# Altium schematic sheet Main.SchDoc: Плата
size 594 x 420 mm; CompanyName: ООО "ЛАССАРД"; Address1: Address1; Address2: Address2; Address3: Address3; Address4: Address4; DocumentNumber: *Э3; SheetNumber: 1; SheetTotal: 14; Title2str: управления; DocumentType: Схема электрическая принципиальная
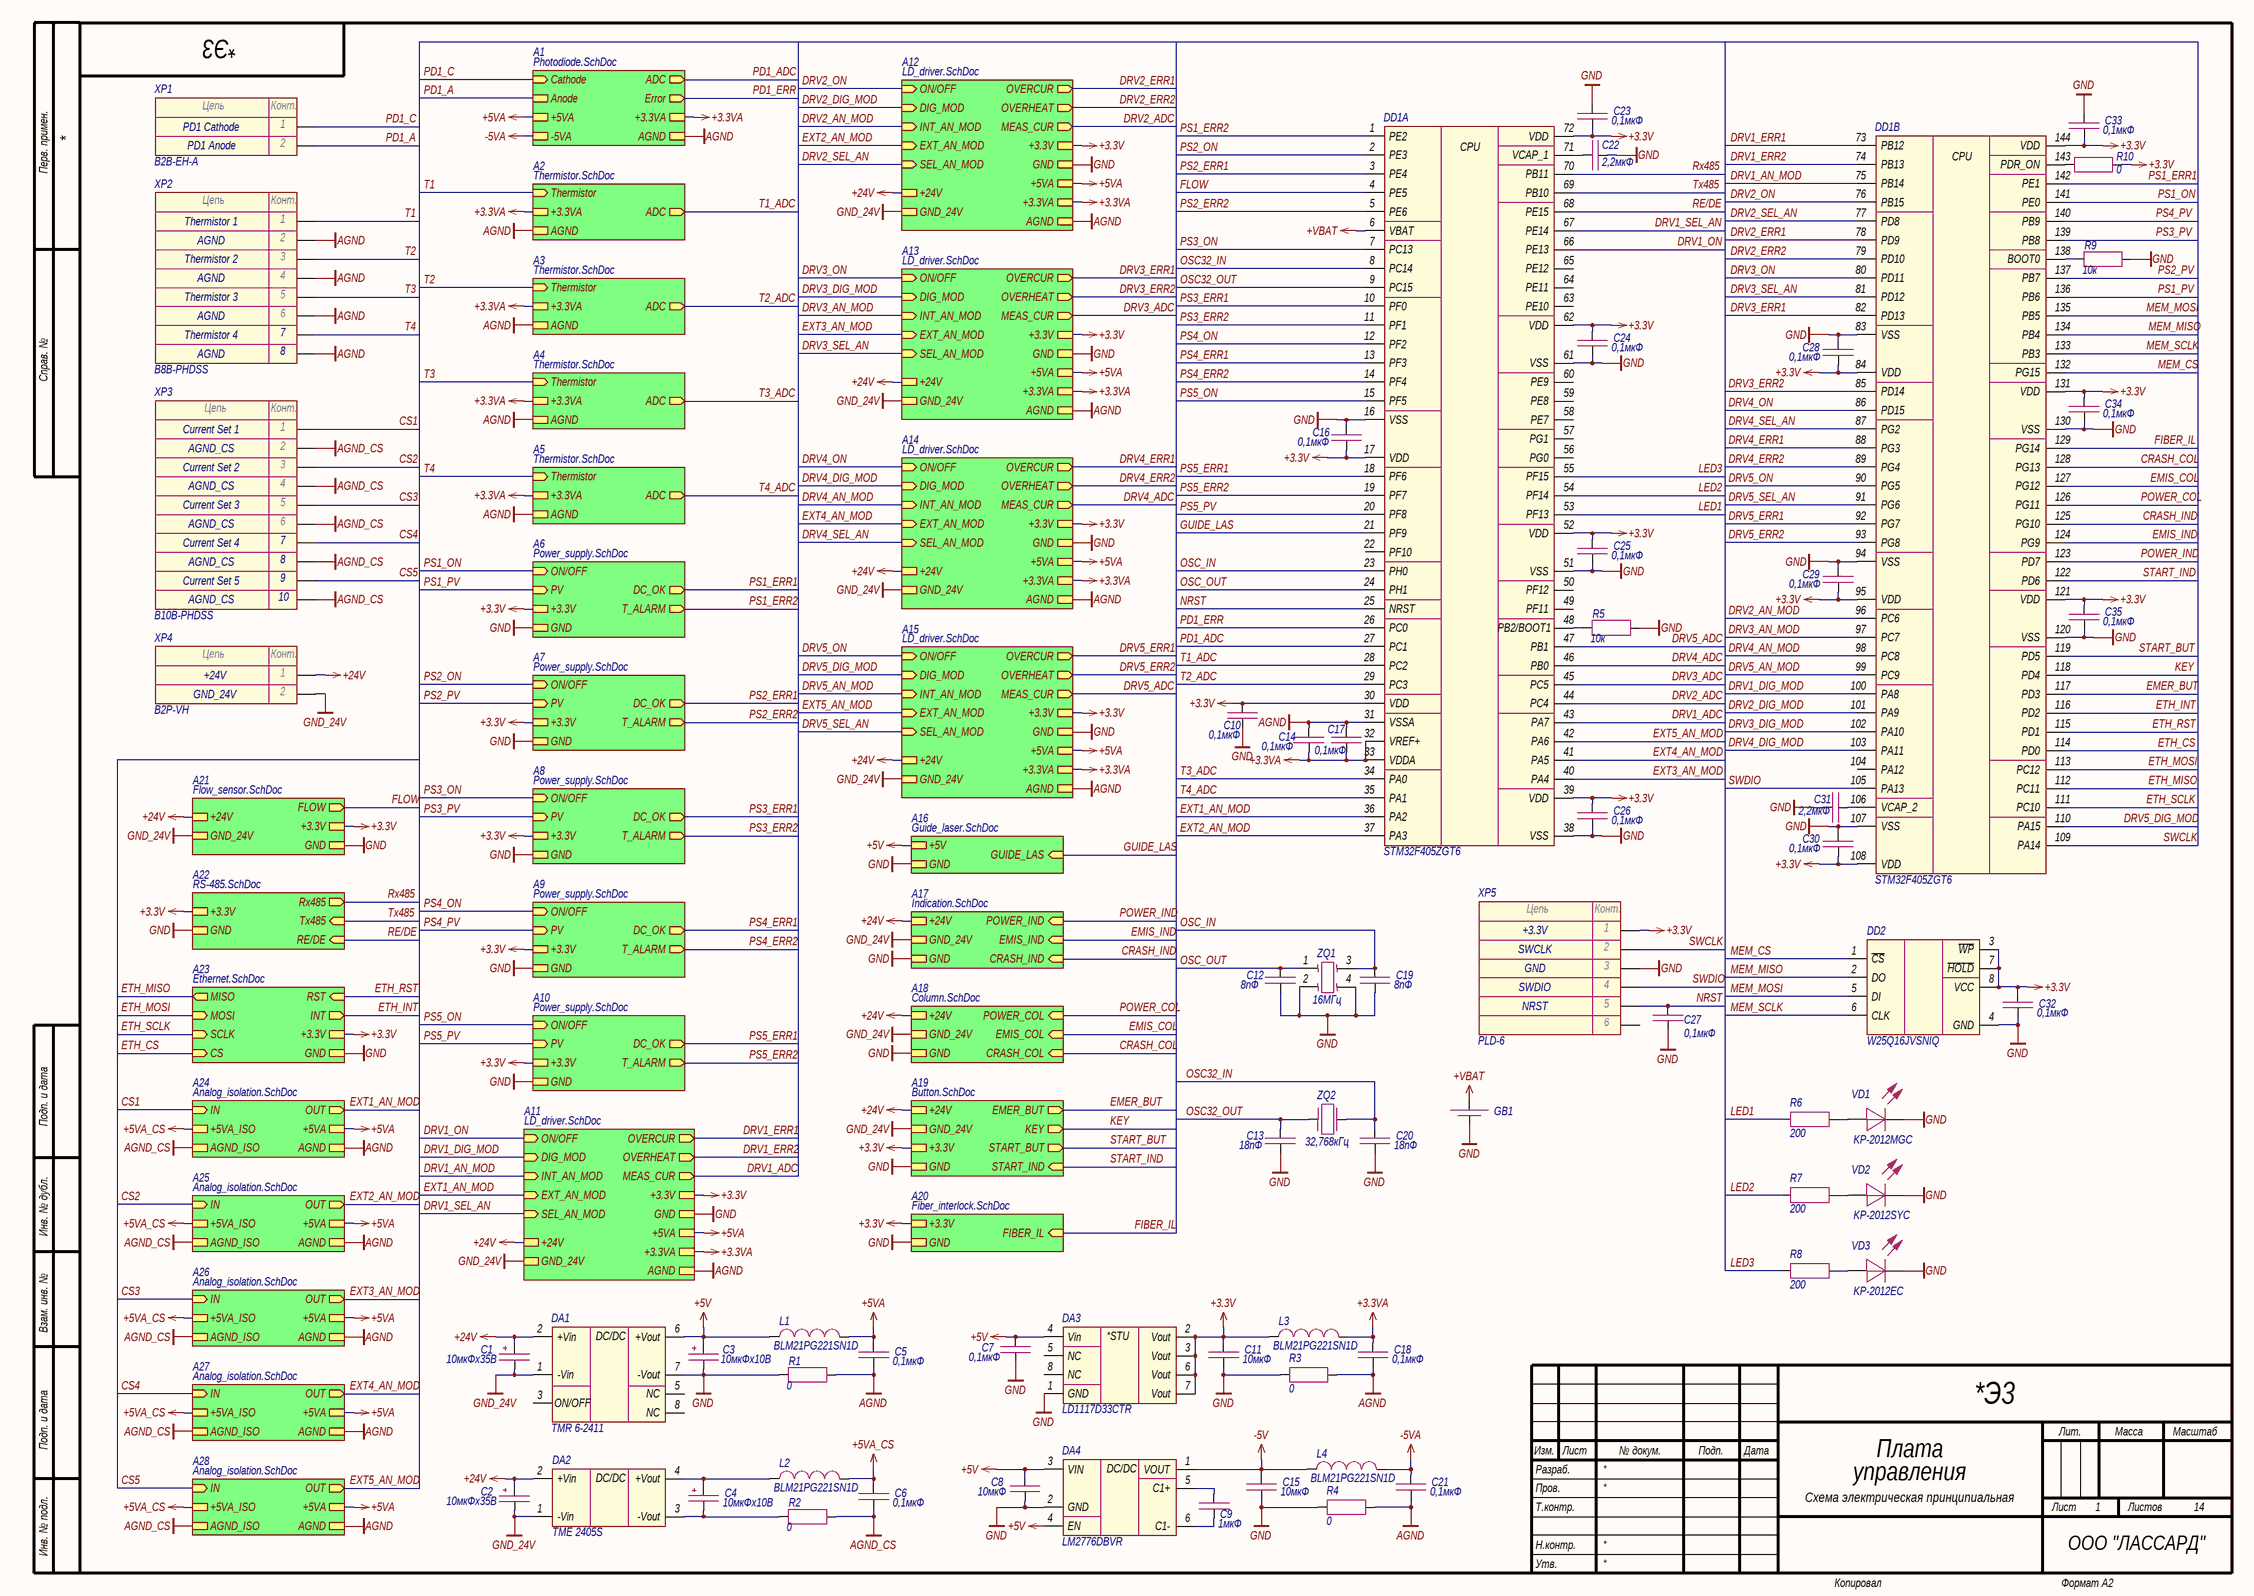
[diagram p0: Main.SchDoc]

## Parts
C1  10мкФх35B  [CAP_C]
C2  10мкФх35B  [CAP_C]
C3  10мкФх10B  [CAP_A]
C4  10мкФх10B  [CAP_A]
C5  0,1мкФ  [CAP_0603]
C6  0,1мкФ  [CAP_0603]
C7  0,1мкФ  [CAP_0603]
C8  10мкФ  [CAP_0603]
C9  1мкФ  [CAP_0603]
C10  0,1мкФ  [CAP_0603]
C11  10мкФ  [CAP_0603]
C12  8пФ  [CAP_0603]
C13  18пФ  [CAP_0603]
C14  0,1мкФ  [CAP_0603]
C15  10мкФ  [CAP_0603]
C16  0,1мкФ  [CAP_0603]
C17  0,1мкФ  [CAP_0603]
C18  0,1мкФ  [CAP_0603]
C19  8пФ  [CAP_0603]
C20  18пФ  [CAP_0603]
C21  0,1мкФ  [CAP_0603]
C22  2,2мкФ  [CAP_0603]
C23  0,1мкФ  [CAP_0603]
C24  0,1мкФ  [CAP_0603]
C25  0,1мкФ  [CAP_0603]
C26  0,1мкФ  [CAP_0603]
C27  0,1мкФ  [CAP_0603]
C28  0,1мкФ  [CAP_0603]
C29  0,1мкФ  [CAP_0603]
C30  0,1мкФ  [CAP_0603]
C31  2,2мкФ  [CAP_0603]
C32  0,1мкФ  [CAP_0603]
C33  0,1мкФ  [CAP_0603]
C34  0,1мкФ  [CAP_0603]
C35  0,1мкФ  [CAP_0603]
DA1  TMR 6-2411  [TMR3 (SIP-8)]
DA2  TME 2405S  [TME (SIP-4)]
DA3  LD1117D33CTR  [SOIC-8]
DA4  LM2776DBVR  [SOT-23-6]
DD1  STM32F405ZGT6  [LQFP-144]  (parts A,B of 2)
DD2  W25Q16JVSNIQ  [SOIC-8]
GB1  DS1092-12-N8S  [DS1092-12-N8S]  (value not drawn)
L1  BLM21PG221SN1D  [IND_0805]
L2  BLM21PG221SN1D  [IND_0805]
L3  BLM21PG221SN1D  [IND_0805]
L4  BLM21PG221SN1D  [IND_0805]
R1  0  [RES_0805]
R2  0  [RES_0805]
R3  0  [RES_0805]
R4  0  [RES_0805]
R5  10к  [RES_0603]
R6  200  [RES_0603]
R7  200  [RES_0603]
R8  200  [RES_0603]
R9  10к  [RES_0603]
R10  0  [RES_0603]
VD1  KP-2012MGC  [LED_0805]
VD2  KP-2012SYC  [LED_0805]
VD3  KP-2012EC  [LED_0805]
XP1  B2B-EH-A  [B2B-EH-A]
XP2  B8B-PHDSS  [B8B-PHDSS]
XP3  B10B-PHDSS  [B10B-PHDSS]
XP4  B2P-VH  [B2P-VH]
XP5  PLD-6  [PLD-6]
ZQ1  16МГц  [NX2520SA]
ZQ2  32,768кГц  [NX3215SA]

## Sub-sheets
A1 = Photodiode.SchDoc: ADC (out), Error (out), AGND, +5VA, +3.3VA, Anode, -5VA, Cathode (in)
A2 = Thermistor.SchDoc: Thermistor (in), +3.3VA, AGND, ADC (out)
A3 = Thermistor.SchDoc: Thermistor (in), +3.3VA, AGND, ADC (out)
A4 = Thermistor.SchDoc: Thermistor (in), +3.3VA, AGND, ADC (out)
A5 = Thermistor.SchDoc: Thermistor (in), +3.3VA, AGND, ADC (out)
A6 = Power_supply.SchDoc: ON/OFF (in), PV (in), +3.3V, GND, DC_OK (out), T_ALARM (out)
A7 = Power_supply.SchDoc: ON/OFF (in), PV (in), +3.3V, GND, DC_OK (out), T_ALARM (out)
A8 = Power_supply.SchDoc: ON/OFF (in), PV (in), +3.3V, GND, DC_OK (out), T_ALARM (out)
A9 = Power_supply.SchDoc: ON/OFF (in), PV (in), +3.3V, GND, DC_OK (out), T_ALARM (out)
A10 = Power_supply.SchDoc: ON/OFF (in), PV (in), +3.3V, GND, DC_OK (out), T_ALARM (out)
A11 = LD_driver.SchDoc: +3.3V, GND, OVERCUR (out), OVERHEAT (out), +24V, GND_24V, ON/OFF (in), DIG_MOD (in), INT_AN_MOD (in), EXT_AN_MOD (in), SEL_AN_MOD (in), MEAS_CUR (out), +5VA, +3.3VA, AGND
A12 = LD_driver.SchDoc: +3.3V, GND, OVERCUR (out), OVERHEAT (out), +24V, GND_24V, ON/OFF (in), DIG_MOD (in), INT_AN_MOD (in), EXT_AN_MOD (in), SEL_AN_MOD (in), MEAS_CUR (out), +5VA, +3.3VA, AGND
A13 = LD_driver.SchDoc: +3.3V, GND, OVERCUR (out), OVERHEAT (out), +24V, GND_24V, ON/OFF (in), DIG_MOD (in), INT_AN_MOD (in), EXT_AN_MOD (in), SEL_AN_MOD (in), MEAS_CUR (out), +5VA, +3.3VA, AGND
A14 = LD_driver.SchDoc: +3.3V, GND, OVERCUR (out), OVERHEAT (out), +24V, GND_24V, ON/OFF (in), DIG_MOD (in), INT_AN_MOD (in), EXT_AN_MOD (in), SEL_AN_MOD (in), MEAS_CUR (out), +5VA, +3.3VA, AGND
A15 = LD_driver.SchDoc: +3.3V, GND, OVERCUR (out), OVERHEAT (out), +24V, GND_24V, ON/OFF (in), DIG_MOD (in), INT_AN_MOD (in), EXT_AN_MOD (in), SEL_AN_MOD (in), MEAS_CUR (out), +5VA, +3.3VA, AGND
A16 = Guide_laser.SchDoc: GUIDE_LAS (in), +5V, GND
A17 = Indication.SchDoc: GND_24V, +24V, CRASH_IND (in), POWER_IND (in), EMIS_IND (in), GND
A18 = Column.SchDoc: GND_24V, +24V, CRASH_COL (in), POWER_COL (in), EMIS_COL (in), GND
A19 = Button.SchDoc: EMER_BUT (out), +24V, GND_24V, +3.3V, GND, KEY (out), START_BUT (out), START_IND (in)
A20 = Fiber_interlock.SchDoc: FIBER_IL (in), +3.3V, GND
A21 = Flow_sensor.SchDoc: FLOW (out), +24V, GND_24V, +3.3V, GND
A22 = RS-485.SchDoc: Rx485 (out), Tx485 (in), RE/DE (in), +3.3V, GND
A23 = Ethernet.SchDoc: MISO (out), RST (in), MOSI (in), INT (out), SCLK (in), CS (in), +3.3V, GND
A24 = Analog_isolation.SchDoc: IN (in), +5VA_ISO, AGND_ISO, OUT (out), AGND, +5VA
A25 = Analog_isolation.SchDoc: IN (in), +5VA_ISO, AGND_ISO, OUT (out), AGND, +5VA
A26 = Analog_isolation.SchDoc: IN (in), +5VA_ISO, AGND_ISO, OUT (out), AGND, +5VA
A27 = Analog_isolation.SchDoc: IN (in), +5VA_ISO, AGND_ISO, OUT (out), AGND, +5VA
A28 = Analog_isolation.SchDoc: IN (in), +5VA_ISO, AGND_ISO, OUT (out), +5VA, AGND

## Nets
+3.3V: C10.1 C11.1 C16.2 C23.2 C24.1 C25.1 C26.1 C28.2 C29.2 C30.2 C32.1 C33.2 C34.1 C35.1 DA3.2(Vout) DA3.3(Vout) DA3.6(Vout) DA3.7(Vout) DD1.17(VDD) DD1.30(VDD) DD1.39(VDD) DD1.52(VDD) DD1.62(VDD) DD1.72(VDD) DD1.84(VDD) DD1.95(VDD) DD1.108(VDD) DD1.121(VDD) DD1.131(VDD) DD1.144(VDD) DD2.3(~{WP}) DD2.7(~{HOLD}) DD2.8(VCC) L3.1 R10.2 XP5.1 ; sheet A6/+3.3V, sheet A7/+3.3V, sheet A8/+3.3V, sheet A9/+3.3V, sheet A10/+3.3V, sheet A11/+3.3V, sheet A12/+3.3V, sheet A13/+3.3V, sheet A14/+3.3V, sheet A15/+3.3V, sheet A19/+3.3V, sheet A20/+3.3V, sheet A21/+3.3V, sheet A22/+3.3V, sheet A23/+3.3V
+3.3VA: C14.2 C17.2 C18.1 DD1.32(VREF+) DD1.33(VDDA) L3.2 ; sheet A1/+3.3VA, sheet A5/+3.3VA, sheet A2/+3.3VA, sheet A3/+3.3VA, sheet A4/+3.3VA, sheet A11/+3.3VA, sheet A12/+3.3VA, sheet A13/+3.3VA, sheet A14/+3.3VA, sheet A15/+3.3VA
+5V: C3.1 C7.2 C8.1 DA1.6(+Vout) DA3.4(Vin) DA4.3(VIN) DA4.4(EN) L1.1 ; sheet A16/+5V
+5VA: C5.1 L1.2 ; sheet A1/+5VA, sheet A11/+5VA, sheet A12/+5VA, sheet A13/+5VA, sheet A14/+5VA, sheet A15/+5VA, sheet A24/+5VA, sheet A25/+5VA, sheet A26/+5VA, sheet A27/+5VA, sheet A28/+5VA
+5VA_CS: C6.1 L2.2 ; sheet A24/+5VA_ISO, sheet A25/+5VA_ISO, sheet A26/+5VA_ISO, sheet A27/+5VA_ISO, sheet A28/+5VA_ISO
+24V: C1.1 C2.1 DA1.2(+Vin) DA2.2(+Vin) XP4.1 ; sheet A11/+24V, sheet A12/+24V, sheet A13/+24V, sheet A14/+24V, sheet A15/+24V, sheet A17/+24V, sheet A18/+24V, sheet A19/+24V, sheet A21/+24V
+VBAT: DD1.6(VBAT) GB1.2
-5V: C15.1 DA4.1(VOUT) L4.1
-5VA: C21.1 L4.2 ; sheet A1/-5VA
AGND: C5.2 C14.1 C17.1 C18.2 C21.2 DD1.31(VSSA) R1.2 R3.2 R4.2 XP2.2 XP2.4 XP2.6 XP2.8 ; sheet A1/AGND, sheet A5/AGND, sheet A2/AGND, sheet A3/AGND, sheet A4/AGND, sheet A11/AGND, sheet A12/AGND, sheet A13/AGND, sheet A14/AGND, sheet A15/AGND, sheet A24/AGND, sheet A25/AGND, sheet A26/AGND, sheet A27/AGND, sheet A28/AGND
AGND_CS: C6.2 R2.2 XP3.2 XP3.4 XP3.6 XP3.8 XP3.10 ; sheet A24/AGND_ISO, sheet A25/AGND_ISO, sheet A26/AGND_ISO, sheet A27/AGND_ISO, sheet A28/AGND_ISO
GND: C3.2 C7.1 C8.2 C10.2 C11.2 C12.2 C13.2 C15.2 C16.1 C19.2 C20.2 C22.2 C23.1 C24.2 C25.2 C26.2 C27.2 C28.1 C29.1 C30.1 C31.2 C32.2 C33.1 C34.2 C35.2 DA1.7(-Vout) DA3.1(GND) DA4.2(GND) DD1.16(VSS) DD1.38(VSS) DD1.51(VSS) DD1.61(VSS) DD1.83(VSS) DD1.94(VSS) DD1.107(VSS) DD1.120(VSS) DD1.130(VSS) DD2.4(GND) GB1.1 R1.1 R3.1 R4.1 R5.2 R9.2 VD1.2(C) VD2.2(C) VD3.2(C) XP5.3 ZQ1.2 ZQ1.4 ; sheet A6/GND, sheet A7/GND, sheet A8/GND, sheet A9/GND, sheet A10/GND, sheet A11/GND, sheet A12/GND, sheet A13/GND, sheet A14/GND, sheet A15/GND, sheet A16/GND, sheet A17/GND, sheet A18/GND, sheet A19/GND, sheet A20/GND, sheet A21/GND, sheet A22/GND, sheet A23/GND
GND_24V: C1.2 C2.2 DA1.1(-Vin) DA2.1(-Vin) XP4.2 ; sheet A11/GND_24V, sheet A12/GND_24V, sheet A13/GND_24V, sheet A14/GND_24V, sheet A15/GND_24V, sheet A17/GND_24V, sheet A18/GND_24V, sheet A19/GND_24V, sheet A21/GND_24V
CRASH_COL: DD1.128(PG13) ; sheet A18/CRASH_COL
CRASH_IND: DD1.125(PG10) ; sheet A17/CRASH_IND
CS1: XP3.1 ; sheet A24/IN
CS2: XP3.3 ; sheet A25/IN
CS3: XP3.5 ; sheet A26/IN
CS4: XP3.7 ; sheet A27/IN
CS5: XP3.9 ; sheet A28/IN
DRV1_ADC: DD1.43(PA7) ; sheet A11/MEAS_CUR
DRV1_AN_MOD: DD1.75(PB14) ; sheet A11/INT_AN_MOD
DRV1_DIG_MOD: DD1.100(PA8) ; sheet A11/DIG_MOD
DRV1_ERR1: DD1.73(PB12) ; sheet A11/OVERCUR
DRV1_ERR2: DD1.74(PB13) ; sheet A11/OVERHEAT
DRV1_ON: DD1.66(PE13) ; sheet A11/ON/OFF
DRV1_SEL_AN: DD1.67(PE14) ; sheet A11/SEL_AN_MOD
DRV2_ADC: DD1.44(PC4) ; sheet A12/MEAS_CUR
DRV2_AN_MOD: DD1.96(PC6) ; sheet A12/INT_AN_MOD
DRV2_DIG_MOD: DD1.101(PA9) ; sheet A12/DIG_MOD
DRV2_ERR1: DD1.78(PD9) ; sheet A12/OVERCUR
DRV2_ERR2: DD1.79(PD10) ; sheet A12/OVERHEAT
DRV2_ON: DD1.76(PB15) ; sheet A12/ON/OFF
DRV2_SEL_AN: DD1.77(PD8) ; sheet A12/SEL_AN_MOD
DRV3_ADC: DD1.45(PC5) ; sheet A13/MEAS_CUR
DRV3_AN_MOD: DD1.97(PC7) ; sheet A13/INT_AN_MOD
DRV3_DIG_MOD: DD1.102(PA10) ; sheet A13/DIG_MOD
DRV3_ERR1: DD1.82(PD13) ; sheet A13/OVERCUR
DRV3_ERR2: DD1.85(PD14) ; sheet A13/OVERHEAT
DRV3_ON: DD1.80(PD11) ; sheet A13/ON/OFF
DRV3_SEL_AN: DD1.81(PD12) ; sheet A13/SEL_AN_MOD
DRV4_ADC: DD1.46(PB0) ; sheet A14/MEAS_CUR
DRV4_AN_MOD: DD1.98(PC8) ; sheet A14/INT_AN_MOD
DRV4_DIG_MOD: DD1.103(PA11) ; sheet A14/DIG_MOD
DRV4_ERR1: DD1.88(PG3) ; sheet A14/OVERCUR
DRV4_ERR2: DD1.89(PG4) ; sheet A14/OVERHEAT
DRV4_ON: DD1.86(PD15) ; sheet A14/ON/OFF
DRV4_SEL_AN: DD1.87(PG2) ; sheet A14/SEL_AN_MOD
DRV5_ADC: DD1.47(PB1) ; sheet A15/MEAS_CUR
DRV5_AN_MOD: DD1.99(PC9) ; sheet A15/INT_AN_MOD
DRV5_DIG_MOD: DD1.110(PA15) ; sheet A15/DIG_MOD
DRV5_ERR1: DD1.92(PG7) ; sheet A15/OVERCUR
DRV5_ERR2: DD1.93(PG8) ; sheet A15/OVERHEAT
DRV5_ON: DD1.90(PG5) ; sheet A15/ON/OFF
DRV5_SEL_AN: DD1.91(PG6) ; sheet A15/SEL_AN_MOD
EMER_BUT: DD1.117(PD3) ; sheet A19/EMER_BUT
EMIS_COL: DD1.127(PG12) ; sheet A18/EMIS_COL
EMIS_IND: DD1.124(PG9) ; sheet A17/EMIS_IND
ETH_CS: DD1.114(PD0) ; sheet A23/CS
ETH_INT: DD1.116(PD2) ; sheet A23/INT
ETH_MISO: DD1.112(PC11) ; sheet A23/MISO
ETH_MOSI: DD1.113(PC12) ; sheet A23/MOSI
ETH_RST: DD1.115(PD1) ; sheet A23/RST
ETH_SCLK: DD1.111(PC10) ; sheet A23/SCLK
EXT1_AN_MOD: DD1.36(PA2) ; sheet A11/EXT_AN_MOD, sheet A24/OUT
EXT2_AN_MOD: DD1.37(PA3) ; sheet A12/EXT_AN_MOD, sheet A25/OUT
EXT3_AN_MOD: DD1.40(PA4) ; sheet A13/EXT_AN_MOD, sheet A26/OUT
EXT4_AN_MOD: DD1.41(PA5) ; sheet A14/EXT_AN_MOD, sheet A27/OUT
EXT5_AN_MOD: DD1.42(PA6) ; sheet A15/EXT_AN_MOD, sheet A28/OUT
FIBER_IL: DD1.129(PG14) ; sheet A20/FIBER_IL
FLOW: DD1.4(PE5) ; sheet A21/FLOW
GUIDE_LAS: DD1.21(PF9) ; sheet A16/GUIDE_LAS
KEY: DD1.118(PD4) ; sheet A19/KEY
LED1: DD1.53(PF13) R6.1
LED2: DD1.54(PF14) R7.1
LED3: DD1.55(PF15) R8.1
MEM_CS: DD1.132(PG15) DD2.1(~{CS})
MEM_MISO: DD1.134(PB4) DD2.2(DO)
MEM_MOSI: DD1.135(PB5) DD2.5(DI)
MEM_SCLK: DD1.133(PB3) DD2.6(CLK)
NRST: C27.1 DD1.25(NRST) XP5.5
OSC32_IN: C20.1 DD1.8(PC14) ZQ2.2
OSC32_OUT: C13.1 DD1.9(PC15) ZQ2.1
OSC_IN: C19.1 DD1.23(PH0) ZQ1.3
OSC_OUT: C12.1 DD1.24(PH1) ZQ1.1
PD1_A: XP1.2 ; sheet A1/Anode
PD1_ADC: DD1.27(PC1) ; sheet A1/ADC
PD1_C: XP1.1 ; sheet A1/Cathode
PD1_ERR: DD1.26(PC0) ; sheet A1/Error
POWER_COL: DD1.126(PG11) ; sheet A18/POWER_COL
POWER_IND: DD1.123(PD7) ; sheet A17/POWER_IND
PS1_ERR1: DD1.142(PE1) ; sheet A6/DC_OK
PS1_ERR2: DD1.1(PE2) ; sheet A6/T_ALARM
PS1_ON: DD1.141(PE0) ; sheet A6/ON/OFF
PS1_PV: DD1.136(PB6) ; sheet A6/PV
PS2_ERR1: DD1.3(PE4) ; sheet A7/DC_OK
PS2_ERR2: DD1.5(PE6) ; sheet A7/T_ALARM
PS2_ON: DD1.2(PE3) ; sheet A7/ON/OFF
PS2_PV: DD1.137(PB7) ; sheet A7/PV
PS3_ERR1: DD1.10(PF0) ; sheet A8/DC_OK
PS3_ERR2: DD1.11(PF1) ; sheet A8/T_ALARM
PS3_ON: DD1.7(PC13) ; sheet A8/ON/OFF
PS3_PV: DD1.139(PB8) ; sheet A8/PV
PS4_ERR1: DD1.13(PF3) ; sheet A9/DC_OK
PS4_ERR2: DD1.14(PF4) ; sheet A9/T_ALARM
PS4_ON: DD1.12(PF2) ; sheet A9/ON/OFF
PS4_PV: DD1.140(PB9) ; sheet A9/PV
PS5_ERR1: DD1.18(PF6) ; sheet A10/DC_OK
PS5_ERR2: DD1.19(PF7) ; sheet A10/T_ALARM
PS5_ON: DD1.15(PF5) ; sheet A10/ON/OFF
PS5_PV: DD1.20(PF8) ; sheet A10/PV
RE/DE: DD1.68(PE15) ; sheet A22/RE/DE
Rx485: DD1.70(PB11) ; sheet A22/Rx485
START_BUT: DD1.119(PD5) ; sheet A19/START_BUT
START_IND: DD1.122(PD6) ; sheet A19/START_IND
SWCLK: DD1.109(PA14) XP5.2
SWDIO: DD1.105(PA13) XP5.4
T1: XP2.1 ; sheet A2/Thermistor
T1_ADC: DD1.28(PC2) ; sheet A2/ADC
T2: XP2.3 ; sheet A3/Thermistor
T2_ADC: DD1.29(PC3) ; sheet A3/ADC
T3: XP2.5 ; sheet A4/Thermistor
T3_ADC: DD1.34(PA0) ; sheet A4/ADC
T4: XP2.7 ; sheet A5/Thermistor
T4_ADC: DD1.35(PA1) ; sheet A5/ADC
Tx485: DD1.69(PB10) ; sheet A22/Tx485
NetC4_1: C4.1 DA2.4(+Vout) L2.1
NetC4_2: C4.2 DA2.3(-Vout) R2.1
NetC9_1: C9.1 DA4.5(C1+)
NetC9_2: C9.2 DA4.6(C1-)
NetC22_1: C22.1 DD1.71(VCAP_1)
NetC31_1: C31.1 DD1.106(VCAP_2)
NetDD1_48: DD1.48(PB2/BOOT1) R5.1
NetDD1_138: DD1.138(BOOT0) R9.1
NetDD1_143: DD1.143(PDR_ON) R10.1
NetR6_2: R6.2 VD1.1(A)
NetR7_2: R7.2 VD2.1(A)
NetR8_2: R8.2 VD3.1(A)

Not connected (* = marked no-connect by the designer): DA1 3(ON/OFF) 5(NC) 8(NC); DA3 5(NC) 8(NC); DD1 22(PF10) 49(PF11) 50(PF12) 56(PG0) 57(PG1) 58(PE7) 59(PE8) 60(PE9) 63(PE10) 64(PE11) 65(PE12) 104(PA12); XP5 6

## Notes on the sheet
- PD1 Cathode
- PD1 Anode
- Thermistor 1
- AGND
- Thermistor 2
- Thermistor 3
- Thermistor 4
- Current Set 1
- AGND_CS
- Current Set 2
- Current Set 3
- Current Set 4
- Current Set 5
- +24V
- GND_24V
- +3.3V
- GND
- SWDIO
- SWCLK
- NRST
- Перв. примен.
- Справ. №
- Подп. и дата
- Инв. № дубл.
- Взам. инв. №
- Разраб.
- Изм.
- Лист
- № докум.
- Подп.
- Дата
- Лит.
- Масса
- Масштаб
- Пров.
- Т.контр.
- Листов
- Инв. № подл.
- Утв.
- Н.контр.
- Копировал
- Формат А2
- (in symbol Connector-2) Цепь; Конт.
- (in symbol Connector-6) Цепь; Конт.
- (in symbol Connector-8) Цепь; Конт.
- (in symbol Connector-10) Цепь; Конт.
- (in symbol LD1117D33) *STU
- (in symbol LM2776DBVR) DC/DC
- (in symbol STM32F405ZG, part A) CPU
- (in symbol STM32F405ZG, part B) CPU
- (in symbol TME) DC/DC
- (in symbol TMR3) DC/DC

## Library data of the parts
C1 C2 = Capacitor_Polar: Model: TECAP, 10 мкФ, 35 В, тип C, 10%; Value: 10мкФх35B; Document: *; Manufacturer: *
C3 C4 = Capacitor_Polar: Model: TECAP, 10 мкФ, 10 В, тип A, 10%; Value: 10мкФх10B; Document: *; Manufacturer: *
C5-C7 C10 C14 C16-C18 C21 C23-C30 C32-C35 = Capacitor: Manufacturer: Murata; Model: GRM188R71H104KA93D; Value: 0,1мкФ; Document: *
C8 C11 C15 = Capacitor: Manufacturer: Murata; Model: GRM188R61E106KA73D; Value: 10мкФ; Document: *
C9 = Capacitor: Manufacturer: Murata; Model: GRM188R61H105KAALD; Value: 1мкФ; Document: *
C12 C19 = Capacitor: Manufacturer: Yageo; Model: CC0603CRNPO9BN8R0; Value: 8пФ; Document: *
C13 C20 = Capacitor: Manufacturer: Murata; Model: GRM1885C1H180FA01D; Value: 18пФ; Document: *
C22 C31 = Capacitor: Manufacturer: Murata; Model: GRM188R61H225KE11D; Value: 2,2мкФ; Document: *
DA1 = TMR3: Manufacturer: Traco Power; Model: TMR 6-2411; Document: *
DA2 = TME: Manufacturer: Traco Power; Model: TME 2405S; Document: *
DA3 = LD1117D33: Manufacturer: STMicroelectronics; Model: LD1117D33CTR; Document: *
DA4 = LM2776DBVR: Manufacturer: Texas Instruments; Model: LM2776DBVR; Document: *
DD1 = STM32F405ZG: Manufacturer: STMicroelectronics; Model: STM32F405ZGT6; Document: *
DD2 = W25Q: Manufacturer: Winbond; Model: W25Q16JVSNIQ; Document: *
GB1 = Accumulator: Manufacturer: Connfly; Model: DS1092-12-N8S; Document: *
L1-L4 = Inductor: Manufacturer: Murata; Value: *; Model: BLM21PG221SN1D; Document: *
R1-R4 = Resistor: Manufacturer: Yageo; Model: RC0805FR-070RL; Value: 0; Document: *
R5 R9 = Resistor: Manufacturer: Yageo; Model: RC0603FR-0710KL; Value: 10к; Document: *
R6-R8 = Resistor: Manufacturer: Yageo; Model: RC0603FR-07200RL; Value: 200; Document: *
R10 = Resistor: Manufacturer: Yageo; Model: RC0603FR-070RL; Value: 0; Document: *
VD1-VD3 = LED: Manufacturer: Kingbright; Document: *
  VD1: Model: KP-2012MGC
  VD2: Model: KP-2012SYC
  VD3: Model: KP-2012EC
XP1 XP4 = Connector-2: Manufacturer: JST; Document: *
  XP1: Model: B2B-EH-A
  XP4: Model: B2P-VH
XP2 = Connector-8: Manufacturer: JST; Model: B8B-PHDSS; Document: *
XP3 = Connector-10: Manufacturer: JST; Model: B10B-PHDSS; Document: *
XP5 = Connector-6: Manufacturer: Connfly; Model: PLD-6; Document: *
ZQ1 = Quartz_Resonator_4-pin: Manufacturer: NDK; Model: NX2520SA-16MHZ-STD-CSW-5; Value: 16МГц; Document: *
ZQ2 = Quartz_Resonator: Manufacturer: NDK; Model: NX3215SA- 32.768K-STD-MUA-8; Value: 32,768кГц; Document: *